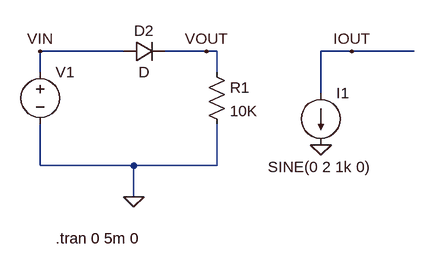
[diagram p0: schematic Draft1.asc]
Draft1.asc, the LTspice schematic file:
Version 4.1
SHEET 1 904 680
WIRE 176 64 48 64
WIRE 304 64 240 64
WIRE 320 64 304 64
WIRE 528 64 480 64
WIRE 624 64 528 64
WIRE 48 96 48 64
WIRE 320 96 320 64
WIRE 480 128 480 64
WIRE 48 240 48 176
WIRE 192 240 48 240
WIRE 320 240 320 176
WIRE 320 240 192 240
WIRE 192 288 192 240
FLAG 192 288 0
FLAG 48 64 VIN
FLAG 304 64 VOUT
FLAG 480 208 0
FLAG 528 64 IOUT
SYMBOL voltage 48 80 R0
WINDOW 3 188 110 Invisible 2
WINDOW 123 0 0 Left 0
WINDOW 39 0 0 Left 0
SYMATTR InstName V1
SYMATTR Value PULSE(0 5 0 1u 1u 10m 20m)
SYMBOL diode 176 80 R270
WINDOW 0 32 32 VTop 2
WINDOW 3 0 32 VBottom 2
SYMATTR InstName D2
SYMBOL res 304 80 R0
SYMATTR InstName R1
SYMATTR Value 10K
SYMBOL current 480 128 R0
WINDOW 3 -81 114 Left 2
WINDOW 123 0 0 Left 0
WINDOW 39 0 0 Left 0
SYMATTR InstName I1
SYMATTR Value SINE(0 2 1k 0)
TEXT 72 352 Left 2 !.tran 0 5m 0

The netlist it stands for:
* Draft1.asc
V1 VIN 0 PULSE(0 5 0 1u 1u 10m 20m)
D2 VIN VOUT D
R1 VOUT 0 10K
I1 IOUT 0 SINE(0 2 1k 0)
.model D D
.lib standard.dio
.tran 0 5m 0
.backanno
.end